# EAGLE design Mixer-Analog-OPA2134-Rev-J (EAGLE 8.5.2)
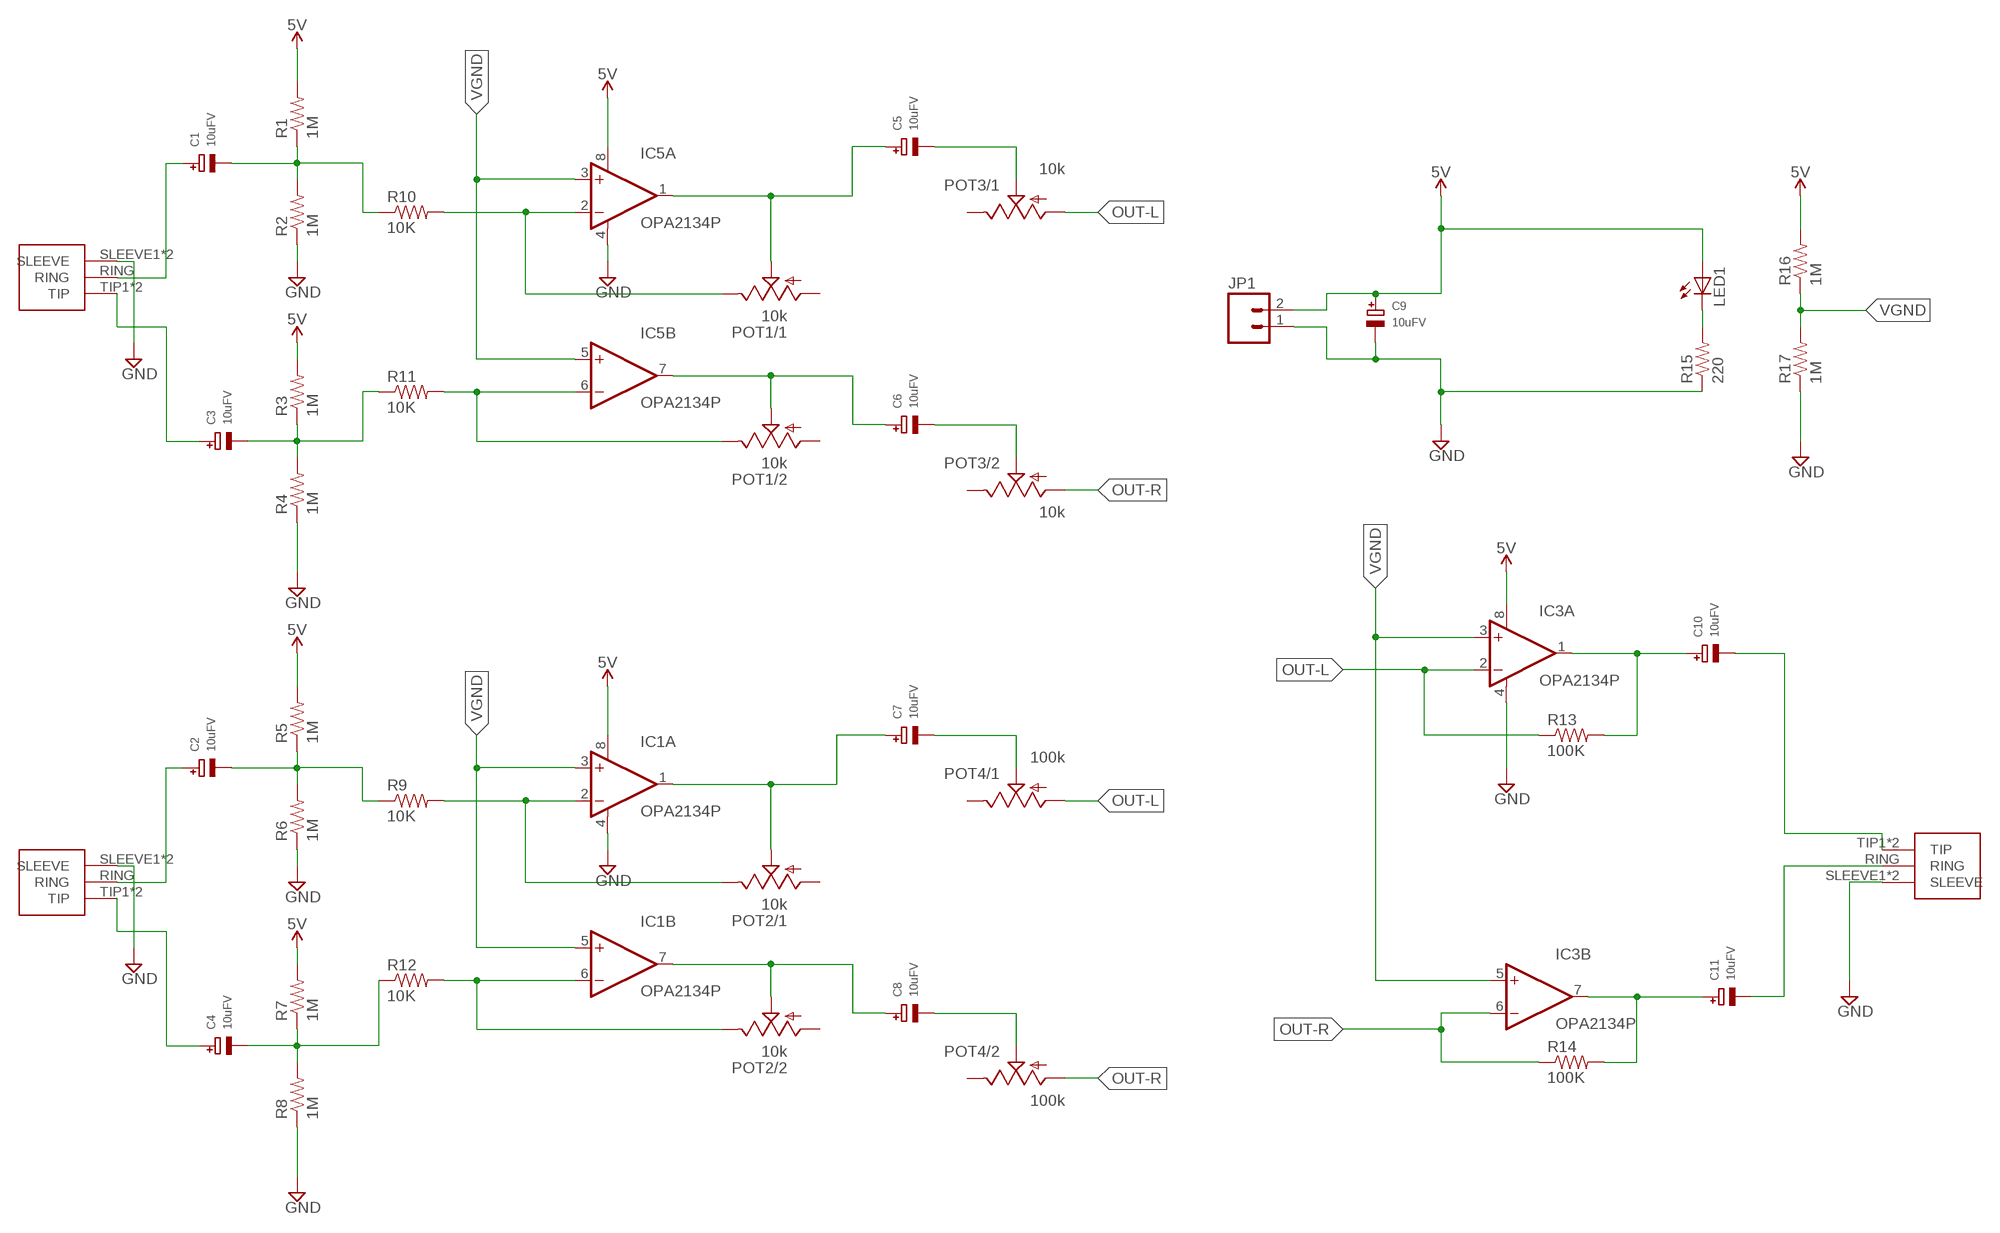
[diagram p0: schematic, sheet 1]

## Parts
C1  10uFV  CAP_ELECTROLYTICPTH_3.5MMGRID_8MMDIA  [CELEC_3.5MM_8MM]
C2  10uFV  CAP_ELECTROLYTICPTH_3.5MMGRID_8MMDIA  [CELEC_3.5MM_8MM]
C3  10uFV  CAP_ELECTROLYTICPTH_3.5MMGRID_8MMDIA  [CELEC_3.5MM_8MM]
C4  10uFV  CAP_ELECTROLYTICPTH_3.5MMGRID_8MMDIA  [CELEC_3.5MM_8MM]
C5  10uFV  CAP_ELECTROLYTICPTH_3.5MMGRID_8MMDIA  [CELEC_3.5MM_8MM]
C6  10uFV  CAP_ELECTROLYTICPTH_3.5MMGRID_8MMDIA  [CELEC_3.5MM_8MM]
C7  10uFV  CAP_ELECTROLYTICPTH_3.5MMGRID_8MMDIA  [CELEC_3.5MM_8MM]
C8  10uFV  CAP_ELECTROLYTICPTH_3.5MMGRID_8MMDIA  [CELEC_3.5MM_8MM]
C9  10uFV  CAP_ELECTROLYTICPTH_3.5MMGRID_8MMDIA  [CELEC_3.5MM_8MM]
C10  10uFV  CAP_ELECTROLYTICPTH_3.5MMGRID_8MMDIA  [CELEC_3.5MM_8MM]
C11  10uFV  CAP_ELECTROLYTICPTH_3.5MMGRID_8MMDIA  [CELEC_3.5MM_8MM]
IC1  OPA2134P  [DIL08]
IC3  OPA2134P  [DIL08]
IC5  OPA2134P  [DIL08]
J1  1/8"-F-STEREO-PCB  [1/8"-F-STEREO-PCB]
J2  1/8"-F-STEREO-PCB  [1/8"-F-STEREO-PCB]
J3  1/8"-F-STEREO-PCB  [1/8"-F-STEREO-PCB]
JP1  M02LOCK  [1X02_LOCK]
LED1  LED3MM  [LED3MM]
POT1  10k  POT-DUAL-PTV112-4420  [PTV112]
POT2  10k  POT-DUAL-PTV112-4420  [PTV112]
POT3  10k  POT-DUAL-PTV112-4420  [PTV112]
POT4  100k  POT-DUAL-PTV112-4420  [PTV112]
R1  1M  RESISTOREZ  [AXIAL-0.3EZ]
R2  1M  RESISTORAXIAL-0.3  [AXIAL-0.3]
R3  1M  RESISTOREZ  [AXIAL-0.3EZ]
R4  1M  RESISTOREZ  [AXIAL-0.3EZ]
R5  1M  RESISTOREZ  [AXIAL-0.3EZ]
R6  1M  RESISTOREZ  [AXIAL-0.3EZ]
R7  1M  RESISTOREZ  [AXIAL-0.3EZ]
R8  1M  RESISTOREZ  [AXIAL-0.3EZ]
R9  10K  RESISTOREZ  [AXIAL-0.3EZ]
R10  10K  RESISTOREZ  [AXIAL-0.3EZ]
R11  10K  RESISTOREZ  [AXIAL-0.3EZ]
R12  10K  RESISTOREZ  [AXIAL-0.3EZ]
R13  100K  RESISTOREZ  [AXIAL-0.3EZ]
R14  100K  RESISTOREZ  [AXIAL-0.3EZ]
R15  220  RESISTOREZ  [AXIAL-0.3EZ]
R16  1M  RESISTOREZ  [AXIAL-0.3EZ]
R17  1M  RESISTOREZ  [AXIAL-0.3EZ]

## Nets
5V: C9.+ IC1.8(A:V+) IC3.8(A:V+) IC5.8(A:V+) JP1.2 LED1.A R1.P$2 R3.P$2 R5.P$2 R7.P$2 R16.P$2
GND: C9.- IC1.4(A:V-) IC3.4(A:V-) IC5.4(A:V-) J1.SLEEVE1(SLEEVE) J1.SLEEVE2(SLEEVE) J2.SLEEVE1(SLEEVE) J2.SLEEVE2(SLEEVE) J3.SLEEVE1(SLEEVE) J3.SLEEVE2(SLEEVE) JP1.1 R2.P$1 R4.P$1 R6.P$1 R8.P$1 R15.P$1 R17.P$1
N$1: IC5.2(A:-IN) POT1.1.3(/1:E) R10.P$2
N$2: C5.- POT3.1.2(/1:S)
N$3: C3.- R3.P$1 R4.P$2 R11.P$1
N$4: IC5.6(B:-IN) POT1.2.3(/2:E) R11.P$2
N$5: C1.+ J1.RING
N$6: C6.- POT3.2.2(/2:S)
N$7: C10.+ IC3.1(A:OUT) R13.P$2
N$8: C4.- R7.P$1 R8.P$2 R12.P$1
N$9: C3.+ J1.TIP1(TIP) J1.TIP2(TIP)
N$10: C7.- POT4.1.2(/1:S)
N$11: C8.- POT4.2.2(/2:S)
N$13: C2.+ J2.RING
N$14: C4.+ J2.TIP1(TIP) J2.TIP2(TIP)
N$15: LED1.K(C) R15.P$2
N$17: C11.+ IC3.7(B:OUT) R14.P$2
N$19: C6.+ IC5.7(B:OUT) POT1.2.2(/2:S)
N$20: C8.+ IC1.7(B:OUT) POT2.2.2(/2:S)
N$22: IC1.2(A:-IN) POT2.1.3(/1:E) R9.P$2
N$23: IC1.6(B:-IN) POT2.2.3(/2:E) R12.P$2
N$54: C2.- R5.P$1 R6.P$2 R9.P$1
N$55: C1.- R1.P$1 R2.P$2 R10.P$1
N$61: C10.- J3.TIP1(TIP) J3.TIP2(TIP)
N$62: C11.- J3.RING
OUT-L: IC3.2(A:-IN) POT3.1.1(/1:A) POT4.1.1(/1:A) R13.P$1
OUT-R: IC3.6(B:-IN) POT3.2.1(/2:A) POT4.2.1(/2:A) R14.P$1
POT1: C5.+ IC5.1(A:OUT) POT1.1.2(/1:S)
POT2: C7.+ IC1.1(A:OUT) POT2.1.2(/1:S)
VGND: IC1.3(A:+IN) IC1.5(B:+IN) IC3.3(A:+IN) IC3.5(B:+IN) IC5.3(A:+IN) IC5.5(B:+IN) R16.P$1 R17.P$2
Unconnected: POT1.1.1(/1:A) POT1.2.1(/2:A) POT2.1.1(/1:A) POT2.2.1(/2:A) POT3.1.3(/1:E) POT3.2.3(/2:E) POT4.1.3(/1:E) POT4.2.3(/2:E)

## Library data of the parts
C1-C11 = microbuilder:CAP_ELECTROLYTIC: Electrolytic Capacitors SMT PANASONIC_C - Size C Panasonic Electrolytic Aluminum Capacitor 47µF 16V 20% Electrolytic Capacitor [Digikey: PCE3890TR-ND] PANASONIC_D - Size D Panasonic Electrolytic Aluminum Capacitor 100µF 25V 20% Electrolytic Capacitor [Digikey: PCE3898TR-ND] PTH 3.5 mm grid, 8 mm diameter ... 3.5 mm grid, 10 mm diameter ...
IC1 IC3 IC5 = burr-brown:OPA2134: Operational Amplifier; MF: TEXAS INSTRUMENTS; MPN: OPA2134PA; OC_FARNELL: 1097574; OC_NEWARK: 74K3897
J1-J3 = CMU-ArtFab:1/8"-F-STEREO-PCB
JP1 = CMU-ArtFab:M02: Header 2 Standard 2-pin 0.1" header. Use with straight break away headers (SKU : PRT-00116), right angle break away headers (PRT-00553), swiss pins (PRT-00743), machine pins (PRT-00117), and female headers (PRT-00115). Molex polarized connector foot print use with SKU : PRT-08233 with associated crimp pins and housings.
LED1 = led:LED: LED OSRAM: - CHIPLED LG R971, LG N971, LY N971, LG Q971, LY Q971, LO R971, LY R971 LH N974, LH R974 LS Q976, LO Q976, LY Q976 LO Q996 - Hyper CHIPLED LW Q18S LB Q993, LB Q99A, LB R99A - SideLED LS A670, LO A670, LY A670, LG A670, LP A670 LB A673, LV A673, LT A673, LW A673 LH A674 LY A675 LS A676, LA A676, LO A676, LY A676, LW A676 LS A679, LY A679, LG A679 - Hyper Micro SIDELED® LS Y876, LA Y876, LO Y876, LY Y876 LT Y87S - SmartLED LW L88C, LW L88S LB L89C, LB L89S, LG L890 LS L89K, LO L89K, LY L89K LS L896, LA L896, LO L896, LY L896 - TOPLED LS T670, LO T670, LY T670, LG T670, LP T670 LSG T670, LSP T670, LSY T670, LOP T670, LYG T670 LG T671, LOG T671, LSG T671 LB T673, LV T673, LT T673, LW T673 LH T674 LS T676, LA T676, LO T676, LY T676, LB T676, LH T676, LSB T676, LW T676 LB T67C, LV T67C, LT T67C, LS T67K, LO T67K, LY T67K, LW E67C LS E67B, LA E67B, LO E67B, LY E67B, LB E67C, LV E67C, LT E67C LW T67C LS T679, LY T679, LG T679 LS T770, LO T770, LY T770, LG T770, LP T770 LB T773, LV T773, LT T773, LW T773 LH T774 LS E675, LA E675, LY E675, LS T675 LS T776, LA T776, LO T776, LY T776, LB T776 LHGB T686 LT T68C, LB T68C - Hyper Mini TOPLED® LB M676 - Mini TOPLED Santana® LG M470 LS M47K, LO M47K, LY M47K Source: http://www.osram.convergy.de LUXEON: - LUMILED® LXK2-PW12-R00, LXK2-PW12-S00, LXK2-PW14-U00, LXK2-PW14-V00 LXK2-PM12-R00, LXK2-PM12-S00, LXK2-PM14-U00 LXK2-PE12-Q00, LXK2-PE12-R00, LXK2-PE12-S00, LXK2-PE14-T00, LXK2-PE14-U00 LXK2-PB12-K00, LXK2-PB12-L00, LXK2-PB12-M00, LXK2-PB14-N00, LXK2-PB14-P00, LXK2-PB14-Q00 LXK2-PR12-L00, LXK2-PR12-M00, LXK2-PR14-Q00, LXK2-PR14-R00 LXK2-PD12-Q00, LXK2-PD12-R00, LXK2-PD12-S00 LXK2-PH12-R00, LXK2-PH12-S00 LXK2-PL12-P00, LXK2-PL12-Q00, LXK2-PL12-R00 Source: www.luxeon.com KINGBRIGHT: KA-3528ASYC Source: www.kingbright.com
POT1 POT2 = CMU-ArtFab:POT-DUAL-PTV112: Bourns 11mm dual potentiometer; AVAILABILITY: Unavailable; DESCRIPTION: Alt# Tce-10111410; MF: STMicroelectronics; MP: PTV112; PACKAGE: None; PRICE: None
POT3 POT4 = CMU-ArtFab:POT-DUAL-PTV112: Bourns 11mm dual potentiometer; AVAILABILITY: Unavailable; DESCRIPTION: Alt# Tce-10111410; MF: STMicroelectronics; MP: PTV112; PACKAGE: None; PRICE: None; SPICEPREFIX: J
R1-R14 = SparkFun-Passives:RESISTOR: Resistor Basic schematic elements and footprints for 0603, 1206, and PTH resistors.; SPICEPREFIX: R
R15-R17 = SparkFun-Passives:RESISTOR: Resistor Basic schematic elements and footprints for 0603, 1206, and PTH resistors.

## Board
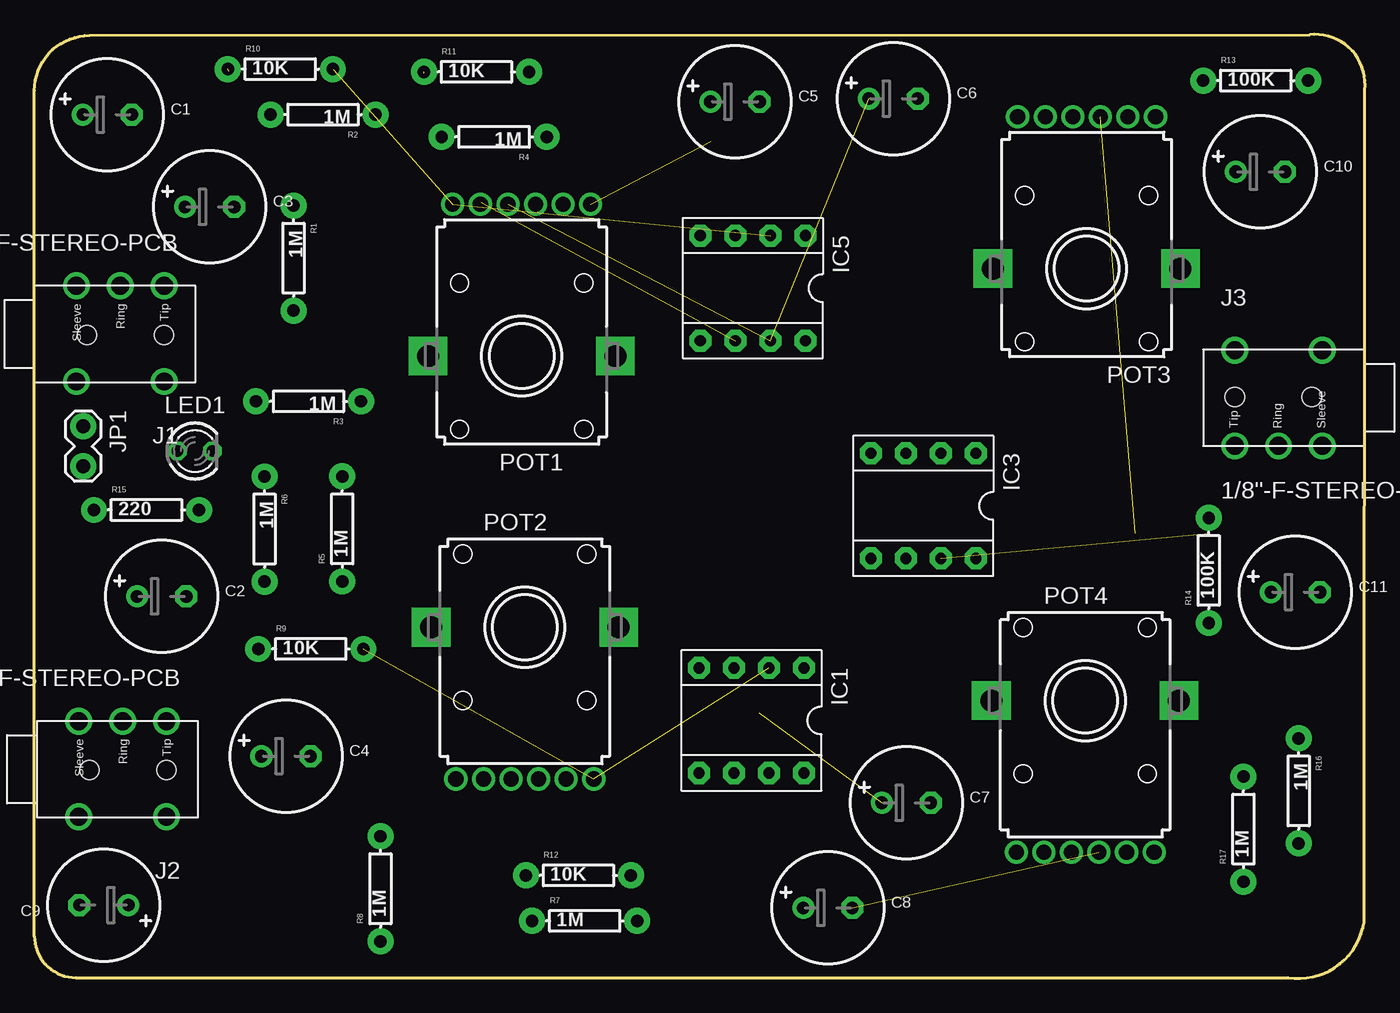
[diagram p1: board, top side]
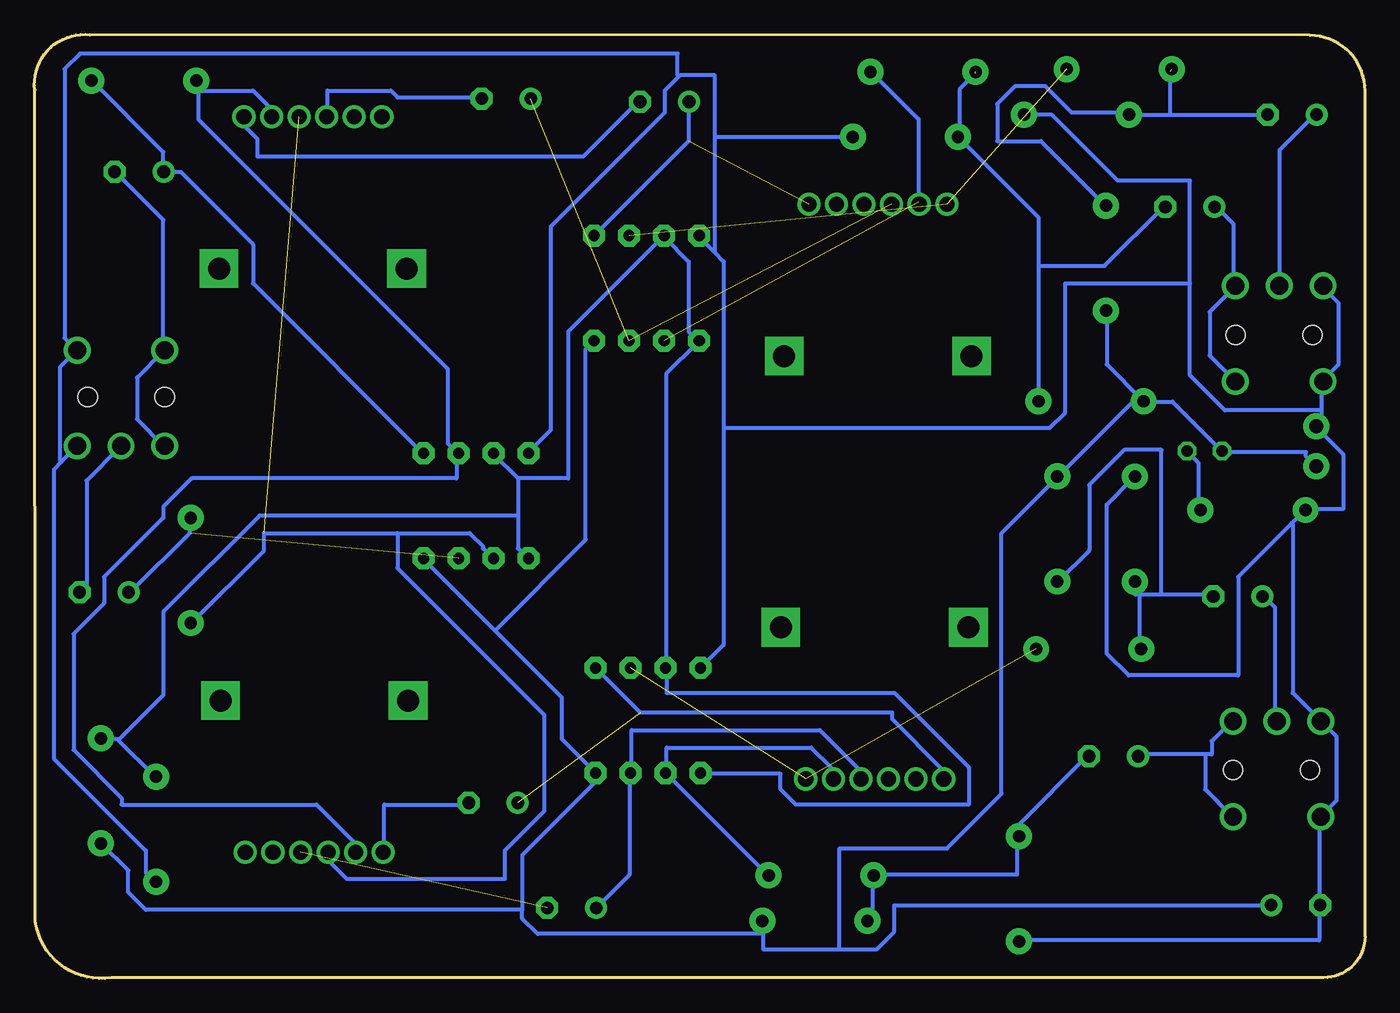
[diagram p2: board, bottom side, seen from below]

Size 96.49 x 68.43 mm. Coordinates in mm from the lower left corner, seen from the top.
Outline: 0,3.06 arc90 3,0.06 90.92,0.06 arc90 96.42,4.06 96.47,64.41 arc103 92.47,68.41 4,68.36 arc90 0,64.36 0,3.06
Copper layers (1*16): Top 0.035mm / dielectric 1.5mm / Bottom 0.035mm
Design rules "default *": minimum track width 12mil, minimum drill 0.35mm, track to track 32mil, track to pad 32mil, pad to pad 32mil, via to via 32mil, smd to smd 24mil, copper to edge 40mil, drill to drill 6mil, minimum pad ring 10mil, minimum via ring 8mil, stop-mask expansion 4mil, vias tented up to drill 0mil, thermal gap 10mil

### Footprints (pad centres in the part's own frame; a part is rotated, then mirrored left to right if it is on the bottom)
CELEC_3.5MM_8MM = drill 0.914 pad 1.6: + -1.778,0 | drill 0.914 pad 1.6 octagon: - 1.778,0
DIL08 = drill 0.813 pad 1.6 octagon: 1 -3.81,-3.81; 2 -1.27,-3.81; 3 1.27,-3.81; 4 3.81,-3.81; 5 3.81,3.81; 6 1.27,3.81; 7 -1.27,3.81; 8 -3.81,3.81
1/8"-F-STEREO-PCB = drill 1.3: RING 5.461,0; SLEEVE1 8.636,6.934; SLEEVE2 8.636,0; TIP1 2.286,6.934; TIP2 2.286,0 | hole 1.4: 2.286,3.556; 7.874,3.556
1X02_LOCK = drill 1.016 pad 1.88: 1 -0.178,0; 2 2.718,0
LED3MM = drill 0.813 octagon: A -1.27,0; K 1.27,0
PTV112 = drill 1.1 pad 1.676: 1.1 -3,-11; 1.2 -5,-11; 1.3 5,-11; 2.1 -1,-11; 2.2 1,-11; 2.3 3,-11 | drill 1.6 pad 2.8 square: M1 -6.8,0; M2 6.8,0
AXIAL-0.3EZ = drill 0.9 pad 1.88: P$1 -3.81,0; P$2 3.81,0
AXIAL-0.3 = drill 0.9 pad 1.88: P$1 -3.81,0; P$2 3.81,0

### Placement (x,y rotation side)
C1  5.28,62.62 0 top
C2  9.22,27.69 0 top
C3  12.7,55.94 0 top
C4  18.24,16.11 0 top
C5  50.8,63.56 0 top
C6  62.28,63.79 0 top
C7  63.22,12.73 0 top
C8  57.53,5.11 0 top
C9  5.03,5.31 180 top
C10  88.9,58.48 0 top
C11  91.44,28 0 top
IC1  51.99,18.7 180 top
IC3  64.46,34.26 180 top
IC5  52.1,50.04 180 top
J1  11.68,50.21 180 top
J2  11.86,18.66 180 top
J3  84.76,38.6 0 top
JP1  3.55,39.84 270 top
LED1  11.64,38.24 0 top
POT1  35.33,45.12 180 top
POT2  35.56,25.46 0 top
POT3  76.3,51.46 180 top
POT4  76.2,20.14 0 top
R1  18.79,52.22 270 top
R2  20.92,62.62 180 top
R3  19.87,41.84 180 top
R4  33.33,61 180 top
R5  22.32,32.58 90 top
R6  16.68,32.58 270 top
R7  39.89,4.17 0 top
R8  25.1,6.5 90 top
R9  20.04,23.88 0 top
R10  17.83,65.92 0 top
R11  32.05,65.72 0 top
R12  39.45,7.47 0 top
R13  88.56,65.09 0 top
R14  85.16,29.58 90 top
R15  8.12,33.96 0 top
R16  91.68,13.6 270 top
R17  87.67,10.82 90 top

### Tracks (layer width: path | path; a pad name or v marks a point on that pad's centre or on a via)
5V
  Bottom 0.305: 63.1,25.22 68.26,30.38 IC3.8 | 63.1,25.22 58.26,20.38 58.26,17.36 55.88,14.98 IC1.8 55.88,14.82 55.88,14.19 61.12,8.95 61.12,4.98 | 63.1,25.22 56.52,31.81 56.52,45.62 56.04,46.09 IC5.8 | 61.12,4.98 88.42,4.98 89.69,6.25 89.69,7.84 91.6,9.74 R16.P$2 | JP1.2 3.65,37.2 4.29,37.84 4.29,38.16 10.32,38.16 LED1.A 10.48,38.32 13.97,41.81 16.03,41.81 R3.P$2 | R3.P$2 16.19,41.97 18.73,44.51 18.73,48.32 R1.P$2 | R3.P$2 16.51,42.13 22.23,36.41 R5.P$2 22.38,36.25 26.35,32.28 26.35,13.39 30.32,9.42 38.1,9.42 38.1,2.12 | 38.1,2.12 43.66,2.12 43.66,3.23 | 38.1,2.12 35.4,2.12 34.13,3.39 34.13,5.3 6.83,5.3 C9.+ | 43.66,3.23 43.66,4.03 R7.P$2 43.66,3.23 | 61.12,4.98 61.12,4.34 60.01,3.23 43.66,3.23
GND
  Bottom 0.305: R8.P$1 25.08,2.76 3.33,2.76 3.33,5.3 C9.- 3.33,5.45 3.33,11.65 J2.SLEEVE1 3.17,11.8 2.06,12.92 2.06,17.52 3.17,18.63 J2.SLEEVE2 3.33,18.79 5.24,20.69 5.24,32.92 5.32,33 | 3.17,41.17 3.17,43.24 J1.SLEEVE1 3.02,43.4 1.91,44.51 1.91,48.95 3.02,50.06 J1.SLEEVE2 | 3.17,41.17 3.17,40.38 3.49,40.06 JP1.1 3.49,39.9 1.59,38 1.59,34.03 4.29,34.03 R15.P$1 4.45,33.87 5.32,33 | 5.32,33 9.21,29.11 9.21,21.96 17.14,21.96 18.73,23.55 18.73,34.35 16.83,36.25 R6.P$1 | 12.7,50.38 12.7,43.71 10.16,41.17 3.17,41.17 | 12.7,50.38 12.7,57.84 17.94,57.84 22.7,62.6 24.61,62.6 R2.P$1 | 94.54,37.44 93.5,38.47 J3.SLEEVE2 | 94.54,37.44 95.09,36.89 95.09,15.93 88.42,9.26 88.42,7.68 87.79,7.04 R17.P$1 | 94.54,37.44 94.61,37.52 94.61,44.35 93.5,45.46 J3.SLEEVE1 93.5,45.62 94.3,46.41 94.3,65.94 93.19,67.05 49.85,67.05 49.85,65.46 49.77,65.38 | 46.51,39.9 46.51,51.97 47.23,52.68 | 46.51,39.9 46.51,24.19 48.1,22.6 IC1.4 | 47.23,52.68 48.26,53.71 IC5.4 | 49.77,65.38 49.69,65.46 47.15,65.46 47.15,61.02 | 49.77,65.38 50.8,64.35 50.8,62.76 59.05,54.51 59.05,39.74 60.64,38.16 IC3.4 | 47.15,61.02 47.15,52.76 47.23,52.68 | 47.15,61.02 37.15,61.02 R4.P$1 | 12.7,50.38 21.75,50.38 21.75,41.01 22.86,39.9 46.51,39.9
N$1  (2 unrouted)
N$2
  Bottom 0.305: C5.- 52.7,63.56 56.67,59.59 80.33,59.59 80.33,60.86 81.28,61.81 81.28,62.45 POT3.1.2
N$3  (1 unrouted)
  Bottom 0.305: 28.26,65.62 29.37,64.51 29.37,61.02 R4.P$2 29.37,60.86 23.65,55.14 23.65,51.65 | 23.65,51.65 18.89,51.65 14.61,55.94 C3.- | 23.65,51.65 23.65,41.97 R3.P$1
N$4  (1 unrouted)
  Bottom 0.305: POT1.2.3 32.38,56.25 32.38,62.29 35.72,65.62 R11.P$2
N$5
  Bottom 0.305: C1.+ 3.65,62.6 6.19,60.06 6.19,50.22 J1.RING
N$6
  Bottom 0.305: C6.- 64.14,63.87 70.17,63.87 70.64,64.35 75.25,64.35 75.25,62.6 POT3.2.2
N$7
  Bottom 0.305: IC3.1 68.42,38.16 80.64,50.38 80.64,53.24 85.88,58.48 C10.+ 87.15,58.48 87.15,59.91 92.23,64.99 R13.P$2
N$8
  Bottom 0.305: R7.P$1 36.04,4.18 35.72,4.5 35.72,7.36 R12.P$1 35.56,7.52 25.24,7.52 25.24,10.22 R8.P$2 25.08,10.38 25.08,11.17 20.16,16.09 C4.-
N$9
  Bottom 0.305: C3.+ 10.79,55.94 9.53,54.67 9.53,50.22 J1.TIP2 9.53,50.06 11.27,48.32 11.27,45.14 9.53,43.4 J1.TIP1
N$10
  Bottom 0.305: C7.- 65.09,12.6 71.12,12.6 71.12,9.26 POT4.1.2
N$11  (1 unrouted)
N$13
  Bottom 0.305: C2.+ 7.3,27.68 6.51,26.89 6.51,18.79 J2.RING
N$14
  Bottom 0.305: 11.59,16.25 11.11,16.25 11.11,17.2 9.68,18.63 J2.TIP2 | 11.59,16.25 16.35,16.25 C4.+ | 11.59,16.25 11.59,13.71 9.68,11.8 J2.TIP1
N$15
  Bottom 0.305: LED1.K 12.86,38.16 12.06,37.36 12.06,34.03 R15.P$2
N$17  (1 unrouted)
  Bottom 0.305: C11.+ 89.53,28 85.25,32.28 85.25,33.24 R14.P$2
N$19  (2 unrouted)
N$20
  Bottom 0.305: C8.+ 55.72,5.14 53.34,7.52 53.34,14.82 IC1.7 53.18,14.98 53.18,18 39.53,18 36.67,15.14 36.67,14.5 POT2.2.2
N$22  (2 unrouted)
N$23
  Bottom 0.305: R12.P$2 43.34,7.52 50.64,14.82 IC1.6 50.64,14.98 50.64,16.73 40.16,16.73 38.73,15.3 38.73,14.66 38.58,14.5 POT2.2.3
N$54
  Bottom 0.305: 16.35,27.84 16.67,27.84 16.67,28.63 R6.P$2 16.35,27.84 | 16.35,27.84 14.76,27.84 | 14.76,27.84 11.11,27.84 C2.- | 16.35,27.84 16.35,24.03 R9.P$1 | 14.76,27.84 14.76,38.32 17.46,38.32 20,35.78 20,31.01 22.23,28.79 R5.P$1
N$55  (1 unrouted)
  Bottom 0.305: 14.13,62.6 16.99,62.6 R2.P$2 17.14,62.76 21.27,62.76 23.18,64.67 25.4,64.67 26.67,63.4 26.67,60.7 23.5,60.7 18.89,56.1 R1.P$1 | 14.13,62.6 7.14,62.6 C1.- | 14.13,62.6 14.13,65.78
N$61
  Bottom 0.305: C10.- 90.65,58.48 87.15,54.98 87.15,45.62 J3.TIP1 87.15,45.46 89.06,43.55 89.06,40.54 87.15,38.63 J3.TIP2
N$62
  Bottom 0.305: C11.- 93.19,28 92.71,28.47 92.71,36.09 90.33,38.47 J3.RING
OUT-L
  Bottom 0.305: 84.61,64.35 84.61,64.99 R13.P$1 84.61,64.35 | 84.61,64.35 84.61,62.29 66.52,44.19 66.52,38.79 65.88,38.16 IC3.2 65.88,38 65.88,36.25 85.09,36.25 87.15,34.19 87.15,33.39 91.44,29.11 91.44,27.2 93.66,24.98 93.66,16.57 90.17,13.07 90.17,12.6 76.04,12.6 73.34,9.9 73.34,9.26 POT4.1.1 | 84.61,64.35 80.64,64.35 79.38,63.08 79.38,62.6 POT3.1.1
OUT-R  (1 unrouted)
  Bottom 0.305: 70.17,32.28 79.85,32.28 79.85,31.01 85.09,25.77 R14.P$1 | 70.17,32.28 64.93,32.28 63.98,31.33 63.98,31.17 63.34,30.54 IC3.6 | 70.17,32.28 70.17,29.74 59.53,19.11 59.53,12.12 62.39,9.26 62.39,7.2 73.82,7.2 75.09,8.47 75.09,9.11 POT4.2.1
POT1  (1 unrouted)
  Bottom 0.305: IC5.1 55.88,53.87 49.05,60.7 49.05,63.56 C5.+
POT2  (1 unrouted)
  Bottom 0.305: IC1.1 55.72,22.44 52.55,19.27 34.29,19.27 34.29,18.79 30.64,15.14 30.64,14.5 POT2.1.2
VGND
  Bottom 0.305: 90.41,17.28 90.49,17.36 91.6,17.36 R16.P$1 | 90.41,17.28 87.79,14.66 R17.P$2 | 61.44,36.25 61.44,33.55 | 61.44,33.55 61.44,31.17 60.8,30.54 IC3.5 | 61.44,36.25 63.18,38 IC3.3 | 90.41,17.28 87.15,20.54 87.15,26.57 80.17,33.55 61.44,33.55 | IC1.5 48.1,14.82 42.39,14.82 42.39,13.71 41.27,12.6 28.73,12.6 28.73,15.3 34.13,20.69 50.64,20.69 50.64,22.44 IC1.3 50.64,22.6 50.64,43.87 48.42,46.09 IC5.5 48.42,46.25 49.05,46.89 49.05,51.97 50.8,53.71 IC5.3 50.96,53.71 57.78,46.89 57.78,36.25 61.44,36.25